# EAGLE design mic4606_power_v2 (EAGLE 6.4)

## Sheet 1 of 5
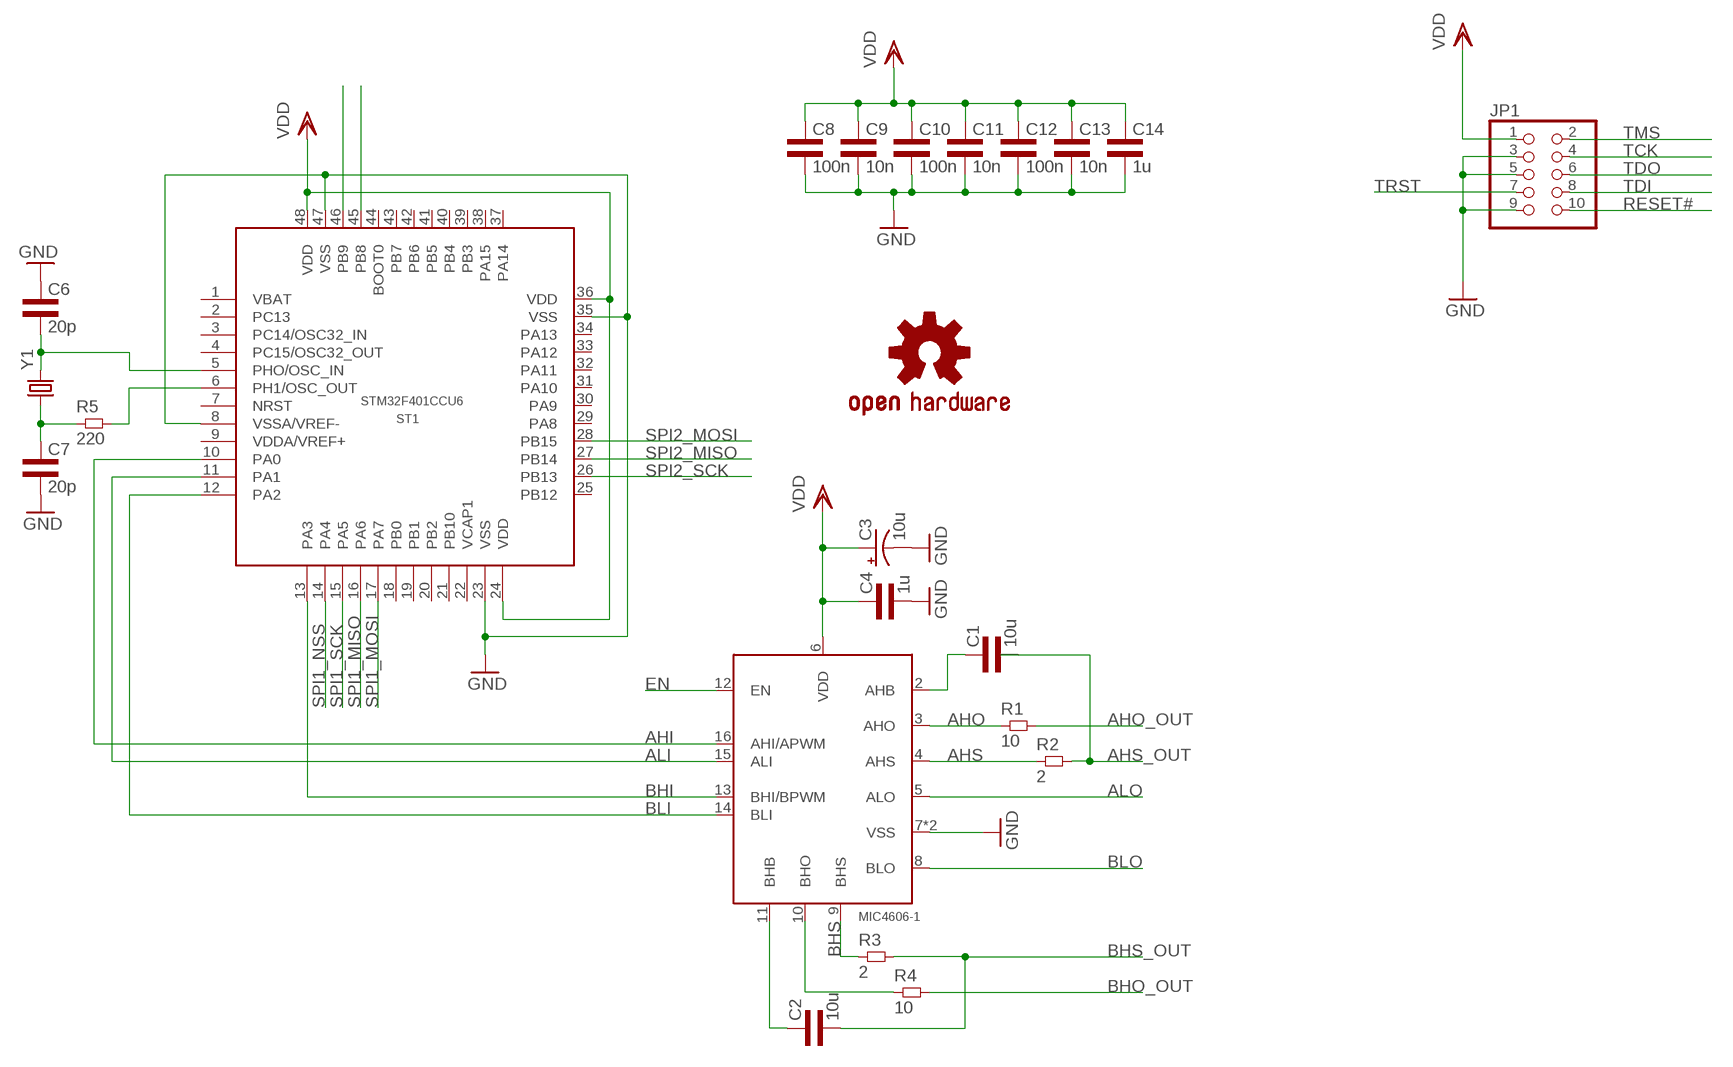
[diagram p0: schematic, sheet 1]

### Parts
C1  10u  CAP0805L3  [0805L3]
C2  10u  CAP0805L3  [0805L3]
C3  10u  CPOL-USE1.8-4  [E1,8-4]
C4  1u  CAP0603L3  [0603L3]
C6  20p  CAP0603L3  [0603L3]
C7  20p  CAP0603L3  [0603L3]
C8  100n  CAP0603L3  [0603L3]
C9  10n  CAP0603L3  [0603L3]
C10  100n  CAP0603L3  [0603L3]
C11  10n  CAP0603L3  [0603L3]
C12  100n  CAP0603L3  [0603L3]
C13  10n  CAP0603L3  [0603L3]
C14  1u  CAP0805L3  [0805L3]
JP1  PINHD-2X5  [2X05]
LOGO1  OSHW-LOGOM  [OSHW-LOGO-M]
MD1  MIC4606-1  [QFN44-16LD-PL-2]
R1  10  RES0805L3  [0805L3]
R2  2  RES0805L3  [0805L3]
R3  2  RES0805L3  [0805L3]
R4  10  RES0805L3  [0805L3]
R5  220  RES0603L3  [0603L3]
ST1  STM32F401CCU6  [UFQFPN48]
Y1  CRYSTALHC49US  [HC49US]

### Nets
AHI: MD1.16(AHI/APWM) ST1.10(PA0)
AHO: MD1.3(AHO) R1.1
AHO_OUT: R1.2
AHS: MD1.4(AHS) R2.1
AHS_OUT: C1.2 R2.2
ALI: MD1.15(ALI) ST1.11(PA1)
ALO: MD1.5(ALO)
BHI: MD1.13(BHI/BPWM) ST1.13(PA3)
BHO: MD1.10(BHO) R4.1
BHO_OUT: R4.2
BHS: MD1.9(BHS) R3.1
BHS_OUT: C2.2 R3.2
BLI: MD1.14(BLI) ST1.12(PA2)
BLO: MD1.8(BLO)
CS_G: ST1.45(PB8) ; also sheet 2
CS_XM: ST1.46(PB9) ; also sheet 2
EN: MD1.12(EN)
GND: C3.- C4.P$2 C6.P$1 C7.P$2 C8.P$2 C9.P$2 C10.P$2 C11.P$2 C12.P$2 C13.P$2 C14.2 JP1.3 JP1.5 JP1.9 MD1.7(VSS) MD1.TP(VSS) ST1.8(VSSA/VREF-) ST1.23(VSS) ST1.35(VSS) ST1.47(VSS) ; also sheet 2,3,4
N$1: C1.1 MD1.2(AHB)
N$3: R5.P$2 ST1.6(PH1/OSC_OUT)
N$5: C7.P$1 R5.P$1 Y1.1
N$9: C2.1 MD1.11(BHB)
N$10: C6.P$2 ST1.5(PHO/OSC_IN) Y1.2
RESET#: JP1.10
SPI1_MISO: ST1.16(PA6) ; also sheet 3
SPI1_MOSI: ST1.17(PA7) ; also sheet 3
SPI1_NSS: ST1.14(PA4) ; also sheet 3
SPI1_SCK: ST1.15(PA5) ; also sheet 3
SPI2_MISO: ST1.27(PB14) ; also sheet 2
SPI2_MOSI: ST1.28(PB15) ; also sheet 2
SPI2_SCK: ST1.26(PB13) ; also sheet 2
TCK: JP1.4
TDI: JP1.8
TDO: JP1.6
TMS: JP1.2
TRST: JP1.7
VDD: C3.+ C4.P$1 C8.P$1 C9.P$1 C10.P$1 C11.P$1 C12.P$1 C13.P$1 C14.1 JP1.1 MD1.6(VDD) ST1.24(VDD) ST1.36(VDD) ST1.48(VDD) ; also sheet 2,3,4
Unconnected: ST1.1(VBAT) ST1.2(PC13) ST1.3(PC14/OSC32_IN) ST1.4(PC15/OSC32_OUT) ST1.7(NRST) ST1.9(VDDA/VREF+) ST1.18(PB0) ST1.19(PB1) ST1.20(PB2) ST1.21(PB10) ST1.22(VCAP1) ST1.25(PB12) ST1.29(PA8) ST1.30(PA9) ST1.31(PA10) ST1.32(PA11) ST1.33(PA12) ST1.34(PA13) ST1.37(PA14) ST1.38(PA15) ST1.39(PB3) ST1.40(PB4) ST1.41(PB5) ST1.42(PB6) ST1.43(PB7) ST1.44(BOOT0)

## Sheet 2 of 5
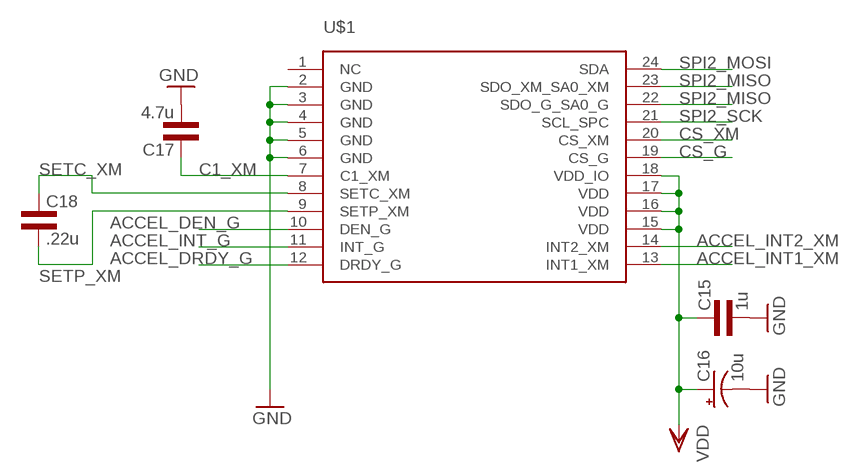
[diagram p1: schematic, sheet 2]

### Parts
C15  1u  CAP0805L3  [0805L3]
C16  10u  CPOL-USCT3216  [CT3216]
C17  4.7u  CAP0603L3  [0603L3]
C18  .22u  CAP0603L3  [0603L3]
U$1  ST_LSM9DS0_TEMP_SENSE_LSM9DS0  [ST_LSM9DS0_TEMP_SENSE_LGA-24]

### Nets
ACCEL_DEN_G: U$1.10(DEN_G)
ACCEL_DRDY_G: U$1.12(DRDY_G)
ACCEL_INT1_XM: U$1.13(INT1_XM)
ACCEL_INT2_XM: U$1.14(INT2_XM)
ACCEL_INT_G: U$1.11(INT_G)
C1_XM: C17.P$1 U$1.7(C1_XM)
CS_G: U$1.19(CS_G) ; also sheet 1
CS_XM: U$1.20(CS_XM) ; also sheet 1
GND: C15.2 C16.- C17.P$2 U$1.2(GND) U$1.3(GND) U$1.4(GND) U$1.5(GND) U$1.6(GND) ; also sheet 1,3,4
SETC_XM: C18.P$1 U$1.8(SETC_XM)
SETP_XM: C18.P$2 U$1.9(SETP_XM)
SPI2_MISO: U$1.22(SDO_G_SA0_G) U$1.23(SDO_XM_SA0_XM) ; also sheet 1
SPI2_MOSI: U$1.24(SDA) ; also sheet 1
SPI2_SCK: U$1.21(SCL_SPC) ; also sheet 1
VDD: C15.1 C16.+ U$1.15(VDD) U$1.16(VDD) U$1.17(VDD) U$1.18(VDD_IO) ; also sheet 1,3,4
Unconnected: U$1.1(NC)

## Sheet 3 of 5
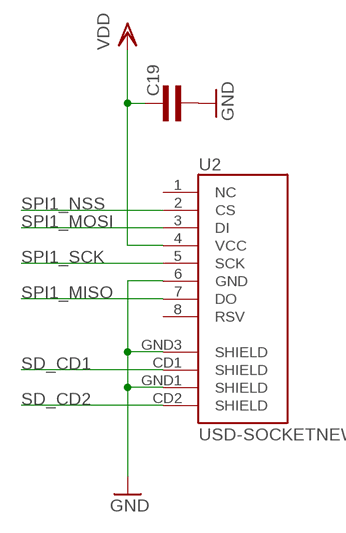
[diagram p2: schematic, sheet 3]

### Parts
C19  CAP0603L3  [0603L3]
U2  USD-SOCKETNEW  [MICRO-SD-SOCKET-PP]

### Nets
GND: C19.P$2 U2.6(GND) U2.GND1(SHIELD) U2.GND3(SHIELD) ; also sheet 1,2,4
SD_CD1: U2.CD1(SHIELD)
SD_CD2: U2.CD2(SHIELD)
SPI1_MISO: U2.7(DO) ; also sheet 1
SPI1_MOSI: U2.3(DI) ; also sheet 1
SPI1_NSS: U2.2(CS) ; also sheet 1
SPI1_SCK: U2.5(SCK) ; also sheet 1
VDD: C19.P$1 U2.4(VCC) ; also sheet 1,2,4
Unconnected: U2.1(NC) U2.8(RSV)

## Sheet 4 of 5
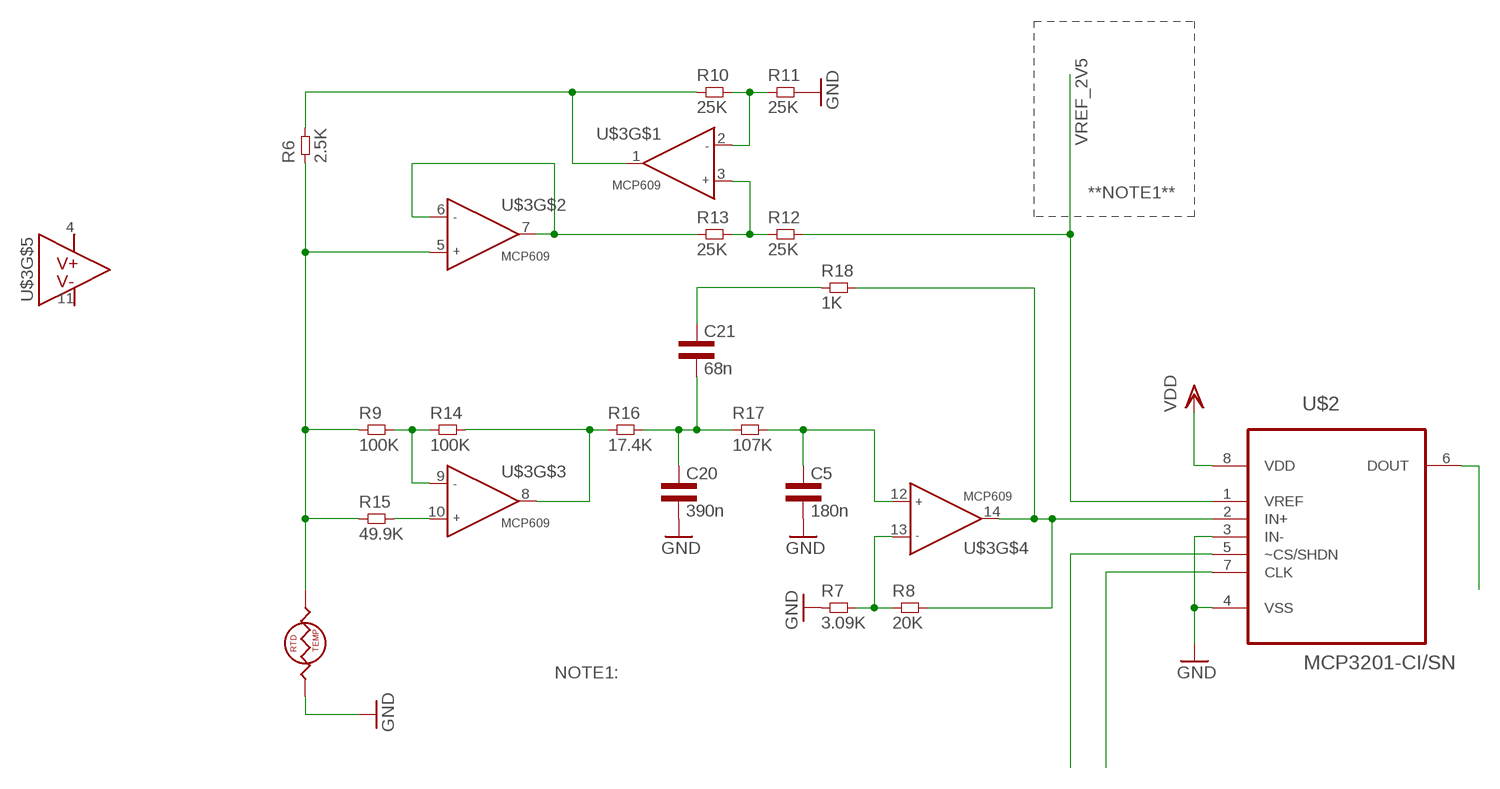
[diagram p3: schematic, sheet 4]

### Parts
C5  180n  CAP0603L3  [0603L3]
C20  390n  CAP0603L3  [0603L3]
C21  68n  CAP0603L3  [0603L3]
R6  2.5K  RES0603L3  [0603L3]
R7  3.09K  RES0603L3  [0603L3]
R8  20K  RES0603L3  [0603L3]
R9  100K  RES0603L3  [0603L3]
R10  25K  RES0603L3  [0603L3]
R11  25K  RES0603L3  [0603L3]
R12  25K  RES0603L3  [0603L3]
R13  25K  RES0603L3  [0603L3]
R14  100K  RES0603L3  [0603L3]
R15  49.9K  RES0603L3  [0603L3]
R16  17.4K  RES0603L3  [0603L3]
R17  107K  RES0603L3  [0603L3]
R18  1K  RES0603L3  [0603L3]
RTD1  RTD0805L1  [0805L1]
U$2  MCP3201-CI/SN  [SOIC127P600X175-8N]
U$3  MCP609  [TSSOP-14]

### Nets
GND: C5.P$2 C20.P$2 R7.P$1 R11.P$2 RTD1.1 U$2.3(IN-) U$2.4(VSS) ; also sheet 1,2,3
N$2: R12.P$1 R13.P$2 U$3.3(INA+)
N$4: R10.P$2 R11.P$1 U$3.2(INA-)
N$6: R13.P$1 U$3.6(INA-) U$3.7(OUTA)
N$7: R8.P$2 R18.P$2 U$2.2(IN+) U$3.14(OUTA)
N$8: R6.P$2 R10.P$1 U$3.1(OUTA)
N$11: R6.P$1 R9.P$1 R15.P$1 RTD1.2 U$3.5(INA+)
N$12: R7.P$2 R8.P$1 U$3.13(INA-)
N$13: R9.P$2 R14.P$1 U$3.9(INA-)
N$14: R15.P$2 U$3.10(INA+)
N$17: R14.P$2 R16.P$1 U$3.8(OUTA)
N$18: C20.P$1 C21.P$2 R16.P$2 R17.P$1
N$19: C5.P$1 R17.P$2 U$3.12(INA+)
N$20: C21.P$1 R18.P$1
N$22: U$2.5(~CS/SHDN)
N$23: U$2.7(CLK)
N$24: U$2.6(DOUT)
VDD: U$2.8(VDD) ; also sheet 1,2,3
VREF_2V5: R12.P$2 U$2.1(VREF)

### Notes on the sheet
- **NOTE1**
- NOTE1:

## Sheet 5 of 5

## Power pins joined to a net without a drawn wire
V+: U$3.4(V+)
V-: U$3.11(V-)

## Library data of the parts
C1 C2 C4-C15 C17-C21 = common:CAP
C3 C16 = rcl:CPOL-US: POLARIZED CAPACITOR, American symbol
JP1 = pinhead:PINHD-2X5: PIN HEADER
LOGO1 = SparkFun-Aesthetics:OSHW-LOGO: Open Source Hardware Logo This logo indicates the piece of hardware it is found on incorporates a OSHW license and/or adheres to the definition of open source hardware found here: http://freedomdefined.org/OSHW
MD1 = common:MIC4606: 85V Full-Bridge Mosfet Driver
R1-R18 = common:RES
RTD1 = common:RTD: Resistive Temperature Detector. Platinum plated ceramic. Comes in various resistances.
ST1 = common:STM32F401CCU6
U2 = SparkFun-Connectors:USD-SOCKET: microSD Socket Push-push type uSD socket. Schematic element and footprint production proven. Spark Fun Electronics SKU : PRT-00127. tDoc lines correctly indicate media card edge positions when inserting (unlocked, locked, depressed).
U$1 = logic:ST_LSM9DS0_TEMP_SENSE_LSM9DS0: The LSM9DS0 is a gyro/accel/magnet sensor produced by ST.
U$2 = Microchip_By_element14_Batch_1:MCP3201-CI/SN: 12Bit A/D Converter; MPN: MCP3201-CI/SN; OC_FARNELL: 3167240; OC_NEWARK: 73K1001; PACKAGE: SOIC-8; SUPPLIER: Microchip
U$3 = common:MCP609
Y1 = SparkFun-FreqCtrl:CRYSTAL: Various standard crystals. Proven footprints. Spark Fun Electronics SKU : COM-00534

## Board
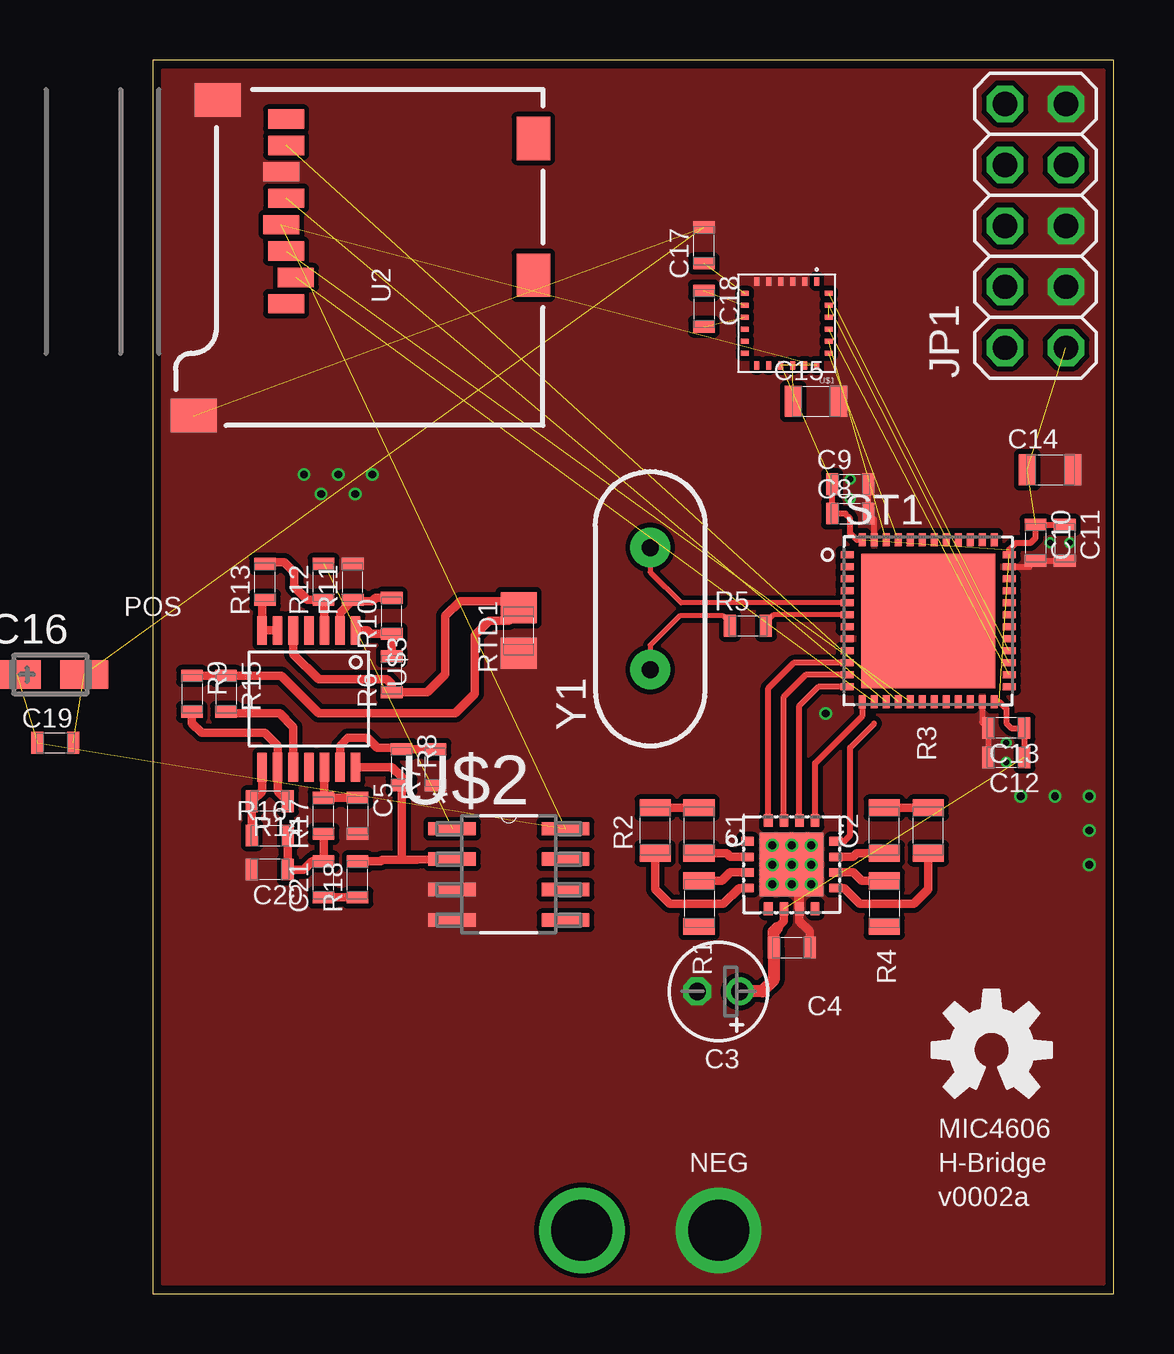
[diagram p4: board, top side]
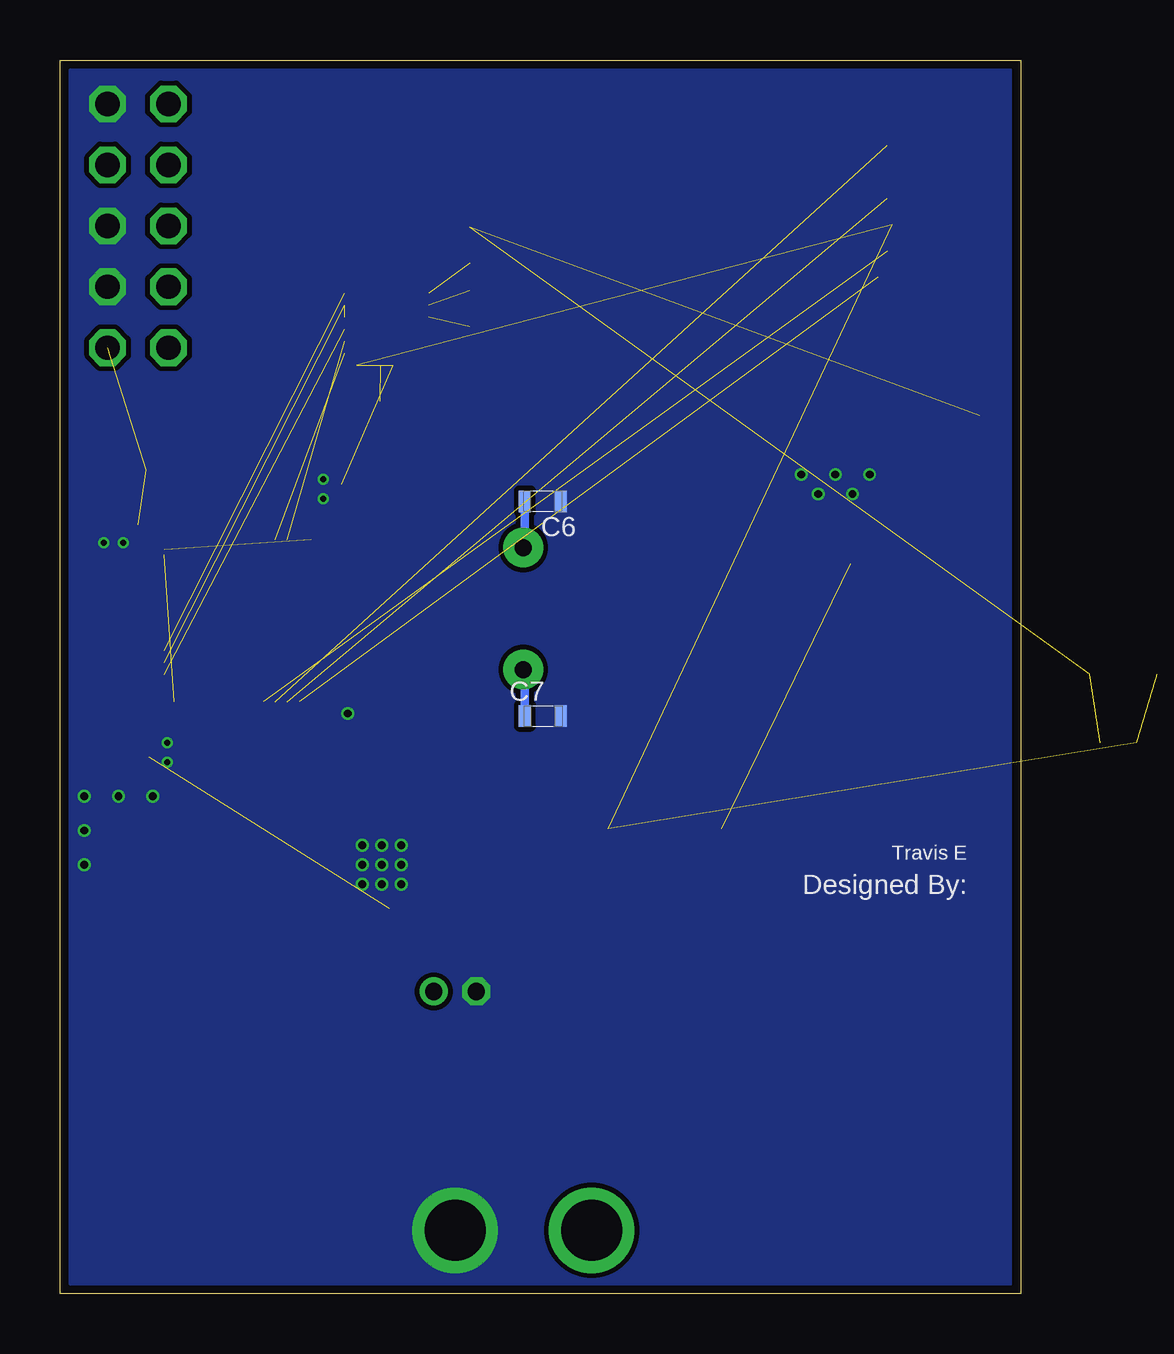
[diagram p5: board, bottom side, seen from below]

Size 40.03 x 51.41 mm. Coordinates in mm from the lower left corner, seen from the top.
Outline: 0,0 40.03,0 40.03,51.41 0,51.41 0,0
Copper layers (1*16): Top 0.035mm / dielectric 1.5mm / Bottom 0.035mm
Design rules "default *": minimum track width 8mil, minimum drill 13mil, track to track 8mil, track to pad 8mil, pad to pad 8mil, via to via 8mil, smd to smd 8mil, copper to edge 13mil, drill to drill 8mil, minimum pad ring 4mil, minimum via ring 4mil, stop-mask expansion 4mil, vias tented up to drill 13mil, thermal gap 10mil

### Footprints (pad centres in the part's own frame; a part is rotated, then mirrored left to right if it is on the bottom)
0805L3 = smd 0.7 x 1.3: 1 -0.95,0; 2 0.95,0
E1,8-4 = drill 0.711 pad 1.168: + -0.889,0 | drill 0.711 pad 1.168 octagon: - 0.889,0
0603L3 = smd 0.5 x 0.9: P$1 -0.75,0; P$2 0.75,0
CT3216 = smd 2 x 1.2: + -1.4,0; - 1.4,0
2X05 = drill 1.016 octagon: 1 -5.08,-1.27; 2 -5.08,1.27; 3 -2.54,-1.27; 4 -2.54,1.27; 5 0,-1.27; 6 0,1.27; 7 2.54,-1.27; 8 2.54,1.27; 9 5.08,-1.27; 10 5.08,1.27
QFN44-16LD-PL-2 = smd 0.53 x 0.36: 1 -1.835,0.975; 2 -1.835,0.325; 3 -1.835,-0.325; 4 -1.835,-0.975; 9 1.835,-0.975; 10 1.835,-0.325; 11 1.835,0.325; 12 1.835,0.975 | smd 0.36 x 0.53: 5 -0.975,-1.835; 6 -0.325,-1.835; 7 0.325,-1.835; 8 0.975,-1.835; 13 0.975,1.835; 14 0.325,1.835; 15 -0.325,1.835; 16 -0.975,1.835 | smd 2.65 x 2.65: TP 0,0
0805L1 = smd 1.3 x 1.5: 1 -0.95,0; 2 0.95,0
UFQFPN48 = smd 0.55 x 0.3: 1 -3.375,2.75; 2 -3.375,2.25; 3 -3.375,1.75; 4 -3.375,1.25; 5 -3.375,0.75; 6 -3.375,0.25; 7 -3.375,-0.25; 8 -3.375,-0.75; 9 -3.375,-1.25; 10 -3.375,-1.75; 11 -3.375,-2.25; 12 -3.375,-2.75; 25 3.375,-2.75; 26 3.375,-2.25; 27 3.375,-1.75; 28 3.375,-1.25; 29 3.375,-0.75; 30 3.375,-0.25; 31 3.375,0.25; 32 3.375,0.75; 33 3.375,1.25; 34 3.375,1.75; 35 3.375,2.25; 36 3.375,2.75 | smd 0.3 x 0.55: 13 -2.75,-3.375; 14 -2.25,-3.375; 15 -1.75,-3.375; 16 -1.25,-3.375; 17 -0.75,-3.375; 18 -0.25,-3.375; 19 0.25,-3.375; 20 0.75,-3.375; 21 1.25,-3.375; 22 1.75,-3.375; 23 2.25,-3.375; 24 2.75,-3.375; 37 2.75,3.375; 38 2.25,3.375; 39 1.75,3.375; 40 1.25,3.375; 41 0.75,3.375; 42 0.25,3.375; 43 -0.25,3.375; 44 -0.75,3.375; 45 -1.25,3.375; 46 -1.75,3.375; 47 -2.25,3.375; 48 -2.75,3.375 | smd 5.6 x 5.6: TP 0,0
MICRO-SD-SOCKET-PP = smd 0.8 x 1.5: 1 -8.94,10.7; 2 -7.84,10.3; 3 -6.74,10.7; 4 -5.64,10.9; 5 -4.54,10.7; 6 -3.44,10.9; 7 -2.34,10.7; 8 -1.24,10.7 | smd 1.8 x 1.4: CD1 -2.05,0.4; CD2 -7.75,0.4 | smd 1.4 x 1.9: GND1 -13.6,14.55; GND3 -0.45,13.55
ST_LSM9DS0_TEMP_SENSE_LGA-24 = smd 0.2 x 0.35: 1 -1.25,-1.75; 2 -0.75,-1.75; 3 -0.25,-1.75; 4 0.25,-1.75; 5 0.75,-1.75; 6 1.25,-1.75; 13 1.25,1.75; 14 0.75,1.75; 15 0.25,1.75; 16 -0.25,1.75; 17 -0.75,1.75; 18 -1.25,1.75 | smd 0.35 x 0.2: 7 1.75,-1.25; 8 1.75,-0.75; 9 1.75,-0.25; 10 1.75,0.25; 11 1.75,0.75; 12 1.75,1.25; 19 -1.75,1.25; 20 -1.75,0.75; 21 -1.75,0.25; 22 -1.75,-0.25; 23 -1.75,-0.75; 24 -1.75,-1.25
SOIC127P600X175-8N = smd 1.981 x 0.559: 1 -2.362,1.905; 2 -2.362,0.635; 3 -2.362,-0.635; 4 -2.362,-1.905; 5 2.362,-1.905; 6 2.362,-0.635; 7 2.362,0.635; 8 2.362,1.905
TSSOP-14 = smd 1.2 x 0.4: 1 -2.85,1.95; 2 -2.85,1.3; 3 -2.85,0.65; 4 -2.85,0; 5 -2.85,-0.65; 6 -2.85,-1.3; 7 -2.85,-1.95; 8 2.85,-1.95; 9 2.85,-1.3; 10 2.85,-0.65; 11 2.85,0; 12 2.85,0.65; 13 2.85,1.3; 14 2.85,1.95
HC49US = drill 0.7 pad 1.651: 1 -2.54,0; 2 2.54,0

### Placement (x,y rotation side)
C1  22.76,19.3 90 top
C2  30.48,19.3 90 top
C3  23.57,12.6 180 top
C4  26.62,14.43 0 top
C5  8.53,19.91 270 top
C6  19.91,33.02 180 bottom
C7  19.91,24.08 0 bottom
C8  29.06,32.51 0 top
C9  29.06,33.73 0 top
C10  36.78,31.29 270 top
C11  38,31.29 270 top
C12  35.56,22.35 180 top
C13  35.56,23.57 180 top
C14  37.39,34.34 0 top
C15  27.64,37.19 0 top
C16  -4.27,25.81 0 top
C17  22.96,43.69 90 top
C18  22.96,41.05 270 top
C19  -4.06,22.96 0 top  (outside the outline)
C20  4.88,17.68 180 top
C21  7.11,17.27 90 top
JP1  36.78,44.5 90 top
LOGO1  34.95,10.16 0 top
MD1  26.62,17.88 0 top
R1  22.76,16.26 270 top
R2  20.93,19.3 90 top
R3  32.31,19.3 90 top
R4  30.48,16.26 270 top
R5  24.79,27.84 0 top
R6  9.96,25.81 90 top
R7  11.79,21.95 90 top
R8  10.36,21.95 270 top
R9  1.63,24.99 270 top
R10  9.96,28.24 90 top
R11  8.33,29.67 90 top
R12  7.11,29.67 90 top
R13  4.67,29.67 90 top
R14  4.88,20.52 180 top
R15  3.05,24.99 270 top
R16  4.88,19.1 0 top
R17  7.11,19.91 90 top
R18  8.53,17.27 90 top
RTD1  15.24,27.64 90 top
ST1  32.31,28.04 0 top
U2  16.26,50.19 90 top
U$1  26.42,40.44 180 top
U$2  14.83,17.48 0 top
U$3  6.5,24.79 270 top
Y1  20.73,28.55 90 top

### Tracks (layer width: path | path; a pad name or v marks a point on that pad's centre or on a via)
AHI
  Top 0.254: ST1.10 26.7,26.29 25.64,25.24 MD1.16
AHO
  Top 0.356: MD1.3 24.06,17.56 23.71,17.21 R1.1
AHS
  Top 0.356: MD1.4 24.43,16.91 23.77,16.26 21.54,16.26 20.93,16.87 R2.1
AHS_OUT
  Top 0.356: R2.2 C1.2
ALI
  Top 0.254: MD1.15 26.29,24.87 27.21,25.79 ST1.11
BAT+  (via drill 2.54)
  other vias: 17.88,2.64
BHI
  Top 0.254: ST1.13 29.56,24.07 27.59,22.11 MD1.13
BHO
  Top 0.356: MD1.10 29.18,17.56 29.53,17.21 R4.1
BHS
  Top 0.356: MD1.9 28.81,16.91 29.46,16.26 31.7,16.26 32.31,16.87 R3.1
BHS_OUT
  Top 0.356: C2.2 R3.2
BLI
  Top 0.254: MD1.14 26.94,24.51 27.73,25.29 ST1.12
C1_XM  (1 unrouted)
CS_G  (1 unrouted)
CS_XM  (1 unrouted)
EN
  Top 0.254: MD1.12 28.81,18.86 29.06,19.1 29.06,22.76 30.06,23.76
GND  (via drill 0.25, 0.33, 2.54)  (3 unrouted)
  Top 0.254: 26.94,17.56 MD1.TP | C11.P$2 C10.P$2 36.53,30.29 ST1.35 | ST1.47 30.06,32.26 C8.P$2 C9.P$2 | ST1.23 34.56,23.82 C13.P$2 C12.P$2
  Top 0.356: MD1.7 26.94,15.52 27.37,15.1 C4.P$2
  Top 0.406: MD1.7 26.94,17.56
  other vias: 23.57,2.64 25.81,18.69 26.62,18.69 27.43,18.69 25.81,17.88 26.62,17.88 27.43,17.88 25.81,17.07 26.62,17.07 27.43,17.07 9.14,34.14 7.72,34.14 6.3,34.14 39.01,20.73 37.59,20.73 36.17,20.73 39.01,19.3 39.01,17.88 7.01,33.32 8.43,33.32 29.06,33.93 29.06,33.12 37.39,31.29 38.2,31.29 35.56,22.96 35.56,22.15 28.04,24.18
  pour Bottom (rank 6, no thermals): 0.41,51 39.62,51 39.62,0.41 0.41,0.41
  pour Top (rank 6, no thermals): 0.41,51 39.62,51 39.62,0.41 0.41,0.41
N$1
  Top 0.356: C1.1 23.91,18.35 24.06,18.21 MD1.2
N$2
  Top 0.356: U$3.3 7.15,28.88 R12.P$1 6.44,28.92 5.89,29.46 5.89,30.07 5.49,30.48 4.74,30.48 R13.P$2
N$3
  Top 0.203: ST1.6 25.85,28.29 25.6,28.04 25.6,27.9 R5.P$2
N$4
  Top 0.356: U$3.2 7.8,28.39 R11.P$1 8.39,28.85 9.14,28.85 9.28,28.99 R10.P$2
N$5
  Top 0.203: R5.P$1 24.04,27.98 23.77,28.24 21.95,28.24 20.73,27.03 Y1.1
  Bottom 0.356: C7.P$1 20.66,25.95 Y1.1
N$6
  Top 0.356: U$3.6 U$3.7 4.55,28.8 R13.P$1
N$7
  Top 0.356: U$3.14 9.96,21.94 10.36,21.54 R8.P$2 10.36,18.08 | R18.P$2 9.49,18.02 9.55,18.08 10.36,18.08 | 10.36,18.08 11.02,18.08 U$2.2
N$8
  Top 0.356: U$3.1 8.94,27.64 9.08,27.49 R10.P$1 R6.P$2
N$9
  Top 0.356: MD1.11 29.18,18.21 29.33,18.35 C2.1
N$10
  Top 0.203: Y1.2 20.73,30.07 22.01,28.79 ST1.5
  Bottom 0.356: C6.P$2 20.66,31.15 Y1.2
N$11
  Top 0.356: U$3.5 5.85,26.66 6.91,25.6 9.75,25.6 9.96,25.4 R6.P$1 11.44,25.06 12.19,25.81 12.19,28.24 12.8,28.85 14.97,28.85 RTD1.2 15.24,28.45 14.83,28.04 14.02,28.04 13.41,27.43 13.41,24.99 12.6,24.18 6.91,24.18 5.35,25.74 R15.P$1 R9.P$1
N$12
  Top 0.356: U$3.13 7.8,22.84 8.13,23.16 8.94,23.16 9.35,22.76 10.3,22.76 R8.P$1 R7.P$2
N$13
  Top 0.356: R9.P$2 1.63,23.77 2.03,23.37 4.67,23.37 5.2,22.84 U$3.9 5.2,20.95 R14.P$1
N$14
  Top 0.356: U$3.10 5.85,23.61 5.28,24.18 3.11,24.18 R15.P$2
N$17
  Top 0.356: R16.P$1 R14.P$2 4.55,20.95 U$3.8
N$18
  Top 0.356: R16.P$2 C20.P$1 6.3,17.68 6.64,18.02 C21.P$2 R17.P$1
N$19
  Top 0.356: U$3.12 7.15,20.7 R17.P$2 C5.P$1
N$20
  Top 0.356: C21.P$1 R18.P$1
SETC_XM  (1 unrouted)
SETP_XM  (1 unrouted)
SPI1_MISO  (1 unrouted)
SPI1_MOSI  (1 unrouted)
SPI1_NSS  (1 unrouted)
SPI1_SCK  (1 unrouted)
SPI2_MISO  (2 unrouted)
SPI2_MOSI  (1 unrouted)
SPI2_SCK  (1 unrouted)
VDD  (14 unrouted)
  Top 0.254: ST1.24 35.28,24.67 35.56,24.38 35.56,23.77 35.76,23.57 C13.P$1 C12.P$1 | ST1.36 35.68,31.01 35.97,31.29 36.58,31.29 36.78,31.5 C10.P$1 C11.P$1 | ST1.48 29.34,31.42 29.06,31.7 29.06,32.31 28.85,32.51 C8.P$1 C9.P$1
  Top 0.356: MD1.6 26.29,15.52 26.01,15.24
  Top 0.508: C3.+ 25.4,12.6 25.87,13.07 C4.P$1 25.87,15.1 26.01,15.24
VREF_2V5  (1 unrouted)

### Text on the board
tPlace: POS | MIC4606 | NEG | H-Bridge | v0002a
bPlace: Travis E | Designed By: